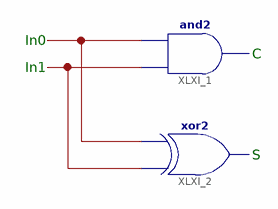
[diagram p0: schematic sheet 1]
// Xilinx ISE schematic HA_scheme.sch (spartan3e) as structural Verilog: 2 symbols, 0 ports
module HA_scheme (
);

  wire XLXN_4, XLXN_5;

  // and2 XLXI_1 has open pins: I0=XLXN_5, I1=XLXN_4, O=open
  // xor2 XLXI_2 has open pins: I0=XLXN_5, I1=XLXN_4, O=open

  // Notes on the sheet:
  //   In0
  //   C
  //   In1
  //   S
endmodule
